# EAGLE design smd_test_rig_with_pico (EAGLE 9.6.2)
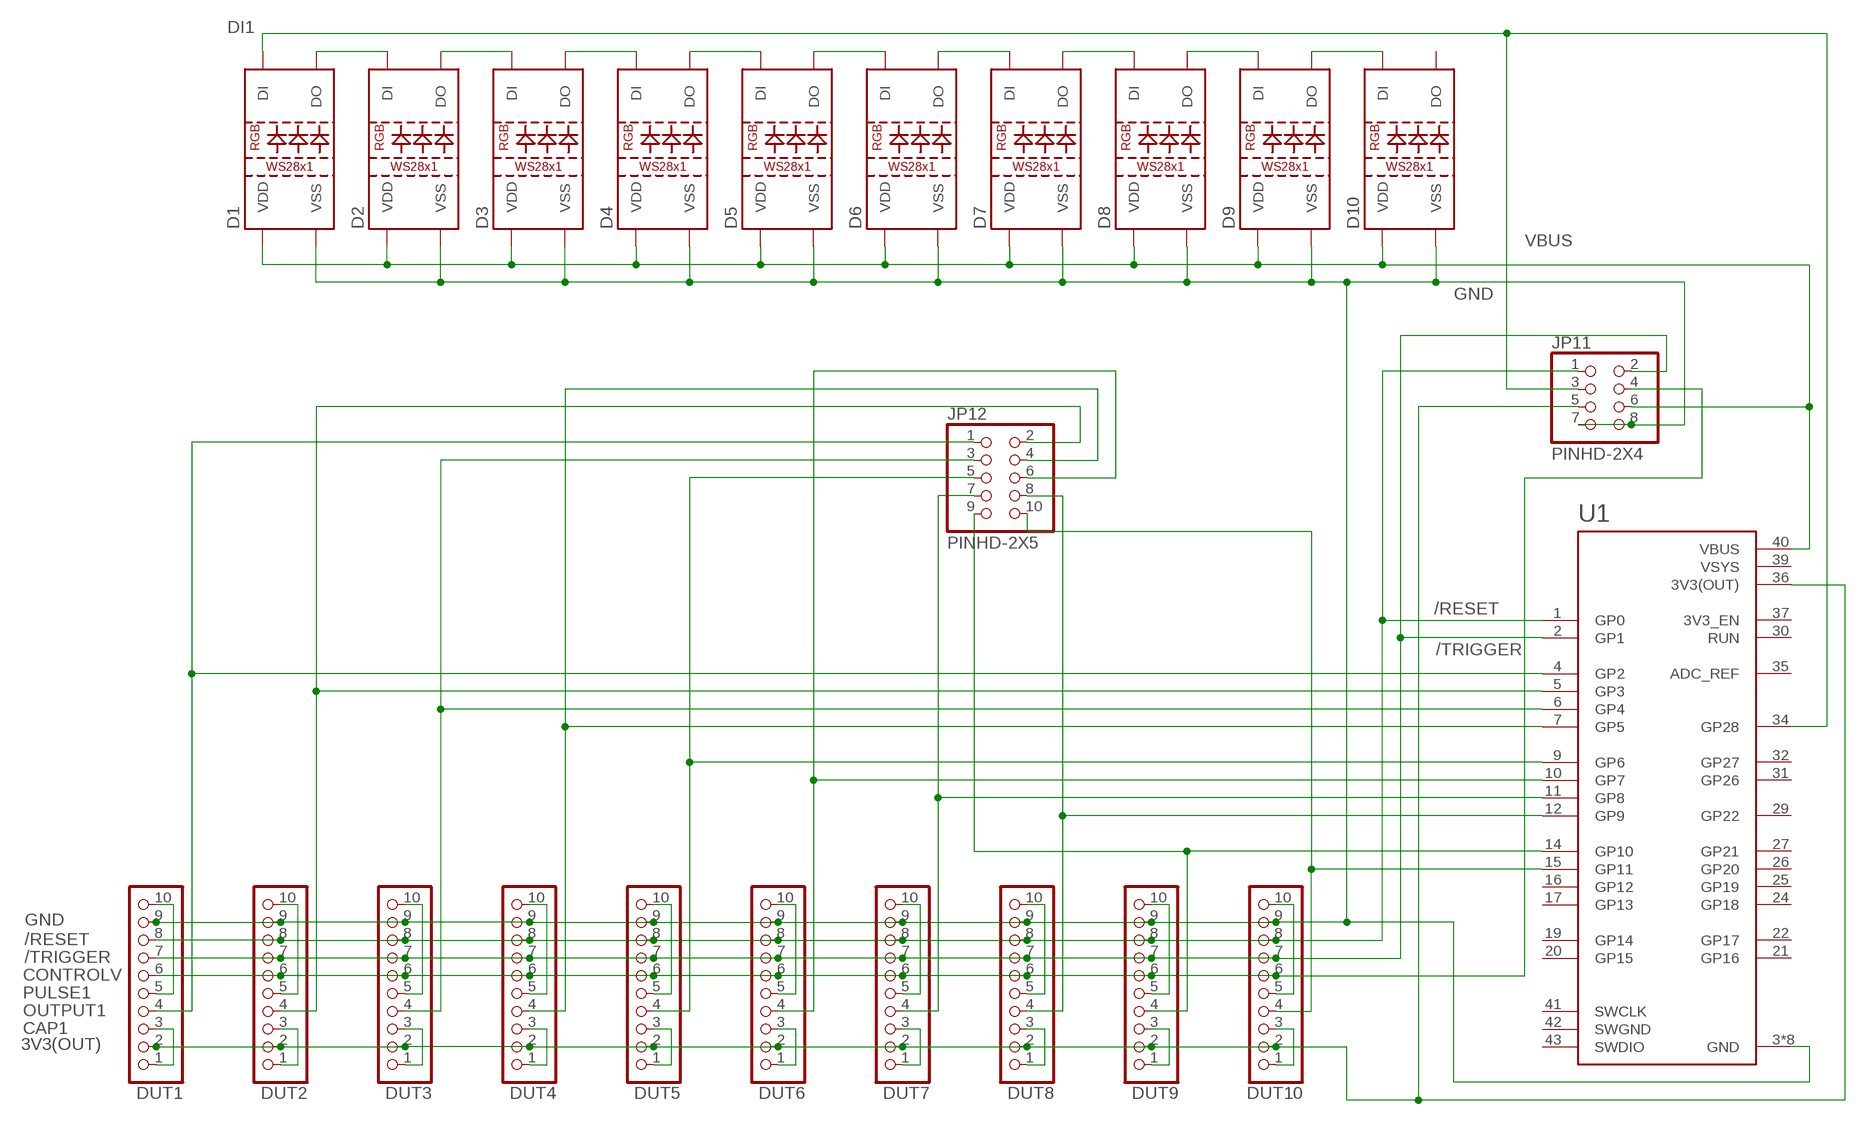
[diagram p0: schematic, sheet 1]

## Parts
D1  WS2812B  [WS2812B]
D2  WS2812B  [WS2812B]
D3  WS2812B  [WS2812B]
D4  WS2812B  [WS2812B]
D5  WS2812B  [WS2812B]
D6  WS2812B  [WS2812B]
D7  WS2812B  [WS2812B]
D8  WS2812B  [WS2812B]
D9  WS2812B  [WS2812B]
D10  WS2812B  [WS2812B]
DUT1  PINHD-1X10  [1X10]
DUT2  PINHD-1X10  [1X10]
DUT3  PINHD-1X10  [1X10]
DUT4  PINHD-1X10  [1X10]
DUT5  PINHD-1X10  [1X10]
DUT6  PINHD-1X10  [1X10]
DUT7  PINHD-1X10  [1X10]
DUT8  PINHD-1X10  [1X10]
DUT9  PINHD-1X10  [1X10]
DUT10  PINHD-1X10  [1X10]
JP11  PINHD-2X4  [2X04]
JP12  PINHD-2X5  [2X05]
U1  RASPBERRY_PICO  RASPBERRY_PICOTH  [PICO-PKG-TH]

## Nets
3V3(OUT): DUT1.2 DUT2.2 DUT3.2 DUT4.2 DUT5.2 DUT6.2 DUT7.2 DUT8.2 DUT9.2 DUT10.2 JP11.5 U1.36(3V3(OUT))
/RESET: DUT1.8 DUT2.8 DUT3.8 DUT4.8 DUT5.8 DUT6.8 DUT7.8 DUT8.8 DUT9.8 DUT10.8 JP11.1 U1.1(GP0)
/TRIGGER: DUT1.7 DUT2.7 DUT3.7 DUT4.7 DUT5.7 DUT6.7 DUT7.7 DUT8.7 DUT9.7 DUT10.7 JP11.2 U1.2(GP1)
CAP1: DUT1.1 DUT1.3
CAP2: DUT2.1 DUT2.3
CAP3: DUT3.1 DUT3.3
CAP4: DUT4.1 DUT4.3
CAP5: DUT5.1 DUT5.3
CAP6: DUT6.1 DUT6.3
CAP7: DUT7.1 DUT7.3
CAP8: DUT8.1 DUT8.3
CAP9: DUT9.1 DUT9.3
CAP10: DUT10.1 DUT10.3
CONTROLV: DUT1.6 DUT2.6 DUT3.6 DUT4.6 DUT5.6 DUT6.6 DUT7.6 DUT8.6 DUT9.6 DUT10.6 JP11.4
DI1: D1.4(DI) JP11.3 U1.34(GP28)
GND: D1.3(VSS) D2.3(VSS) D3.3(VSS) D4.3(VSS) D5.3(VSS) D6.3(VSS) D7.3(VSS) D8.3(VSS) D9.3(VSS) D10.3(VSS) DUT1.9 DUT2.9 DUT3.9 DUT4.9 DUT5.9 DUT6.9 DUT7.9 DUT8.9 DUT9.9 DUT10.9 JP11.7 JP11.8 U1.3(GND) U1.8(GND) U1.13(GND) U1.18(GND) U1.23(GND) U1.28(GND) U1.33(GND) U1.38(GND)
N$1: D1.2(DO) D2.4(DI)
N$2: D2.2(DO) D3.4(DI)
N$3: D3.2(DO) D4.4(DI)
N$4: D4.2(DO) D5.4(DI)
N$5: D5.2(DO) D6.4(DI)
N$6: D6.2(DO) D7.4(DI)
N$7: D7.2(DO) D8.4(DI)
N$8: D8.2(DO) D9.4(DI)
N$9: D9.2(DO) D10.4(DI)
OUTPUT1: DUT1.4 JP12.1 U1.4(GP2)
OUTPUT2: DUT2.4 JP12.2 U1.5(GP3)
OUTPUT3: DUT3.4 JP12.3 U1.6(GP4)
OUTPUT4: DUT4.4 JP12.4 U1.7(GP5)
OUTPUT5: DUT5.4 JP12.5 U1.9(GP6)
OUTPUT6: DUT6.4 JP12.6 U1.10(GP7)
OUTPUT7: DUT7.4 JP12.7 U1.11(GP8)
OUTPUT8: DUT8.4 JP12.8 U1.12(GP9)
OUTPUT9: DUT9.4 JP12.9 U1.14(GP10)
OUTPUT10: DUT10.4 JP12.10 U1.15(GP11)
PULSE1: DUT1.5 DUT1.10
PULSE2: DUT2.5 DUT2.10
PULSE3: DUT3.5 DUT3.10
PULSE4: DUT4.5 DUT4.10
PULSE5: DUT5.5 DUT5.10
PULSE6: DUT6.5 DUT6.10
PULSE7: DUT7.5 DUT7.10
PULSE8: DUT8.5 DUT8.10
PULSE9: DUT9.5 DUT9.10
PULSE10: DUT10.5 DUT10.10
VBUS: D1.1(VDD) D2.1(VDD) D3.1(VDD) D4.1(VDD) D5.1(VDD) D6.1(VDD) D7.1(VDD) D8.1(VDD) D9.1(VDD) D10.1(VDD) JP11.6 U1.40(VBUS)
Unconnected: D10.2(DO) U1.16(GP12) U1.17(GP13) U1.19(GP14) U1.20(GP15) U1.21(GP16) U1.22(GP17) U1.24(GP18) U1.25(GP19) U1.26(GP20) U1.27(GP21) U1.29(GP22) U1.30(RUN) U1.31(GP26) U1.32(GP27) U1.35(ADC_REF) U1.37(3V3_EN) U1.41(SWCLK) U1.43(SWDIO)

## Power pins joined to a net without a drawn wire
SWGND: U1.42(SWGND)
VSYS: U1.39(VSYS)

## Library data of the parts
D1-D10 = SparkFun-LED:WS2812B: WS2812B SMD addressable RGB LED 5x5mm SMD LED with built-in controller IC. Color: Red/Green/Blue mC Rating: RGB: 390, 660, 180 mcd Forward Voltage: RGB: 2.0, 3.0, 3.0 V Packages:WS2812B SparkFun Products: Blynk Board - ESP8266 <https://www.sparkfun.com/products/13794>; PROD_ID: DIO-12503
DUT1-DUT10 = Connector:PINHD-1X10: PIN HEADER; CATEGORY: CONNECTOR; SUB-CATEGORY: PIN-HEADER
JP11 = Connector:PINHD-2X4: PIN HEADER; CATEGORY: CONNECTOR; SUB-CATEGORY: PIN-HEADER
JP12 = Connector:PINHD-2X5: PIN HEADER; CATEGORY: CONNECTOR; SUB-CATEGORY: PIN-HEADER
U1 = RpiPico:RASPBERRY_PICO: Raspberry Pi Pico

## Board
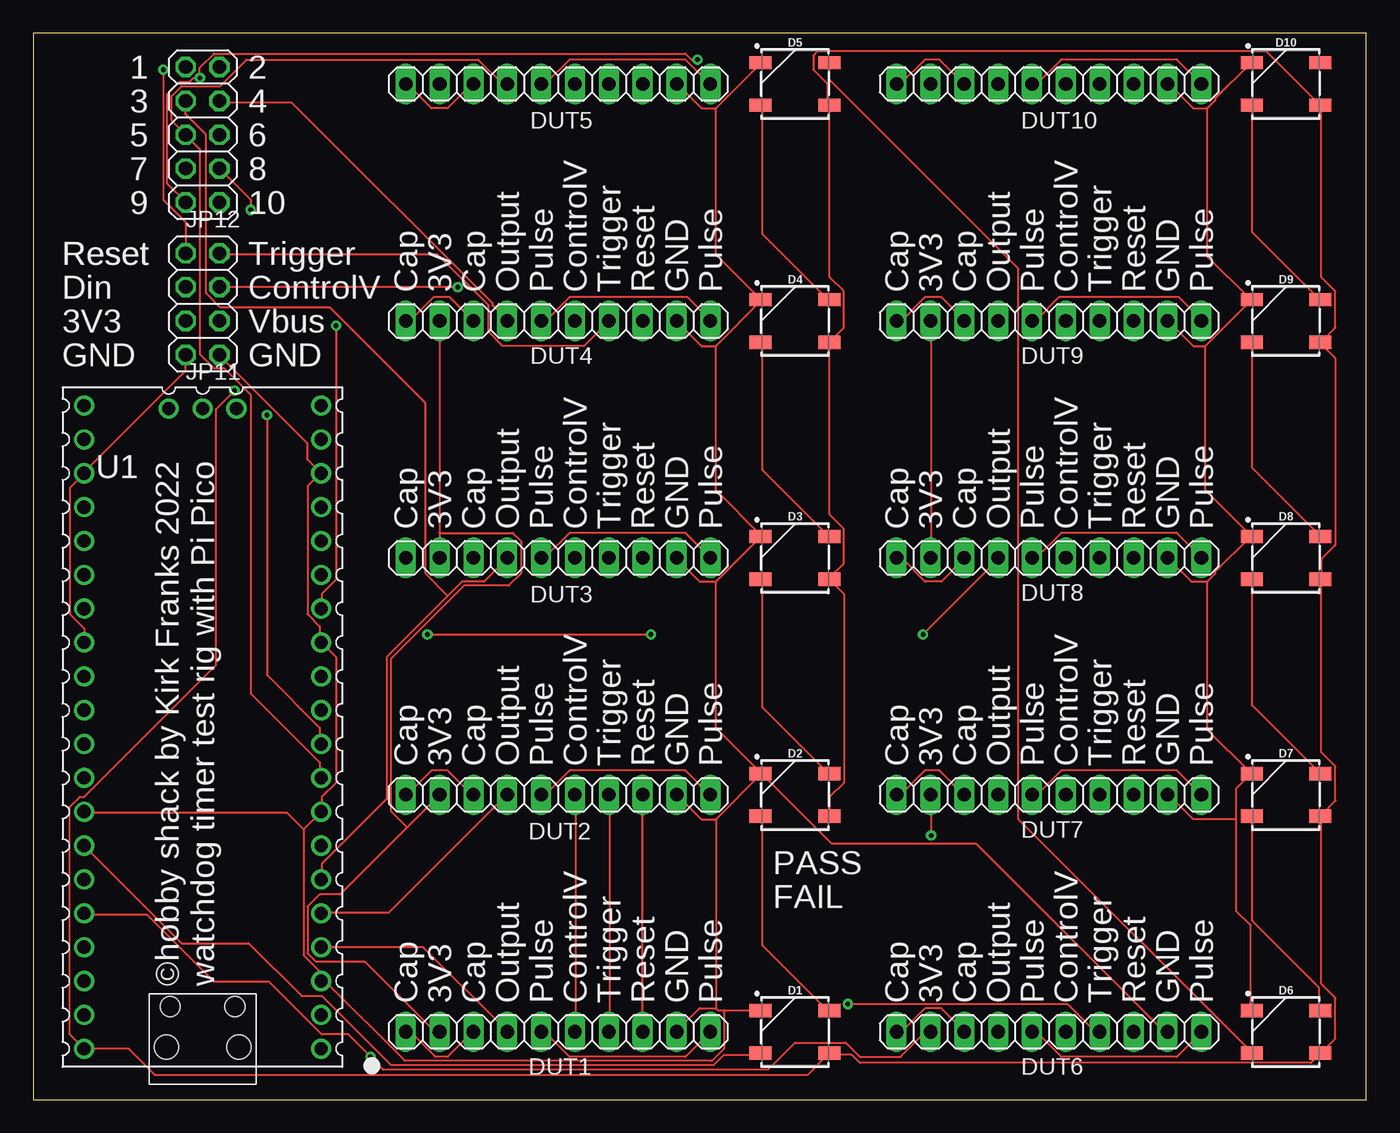
[diagram p1: board, top side]
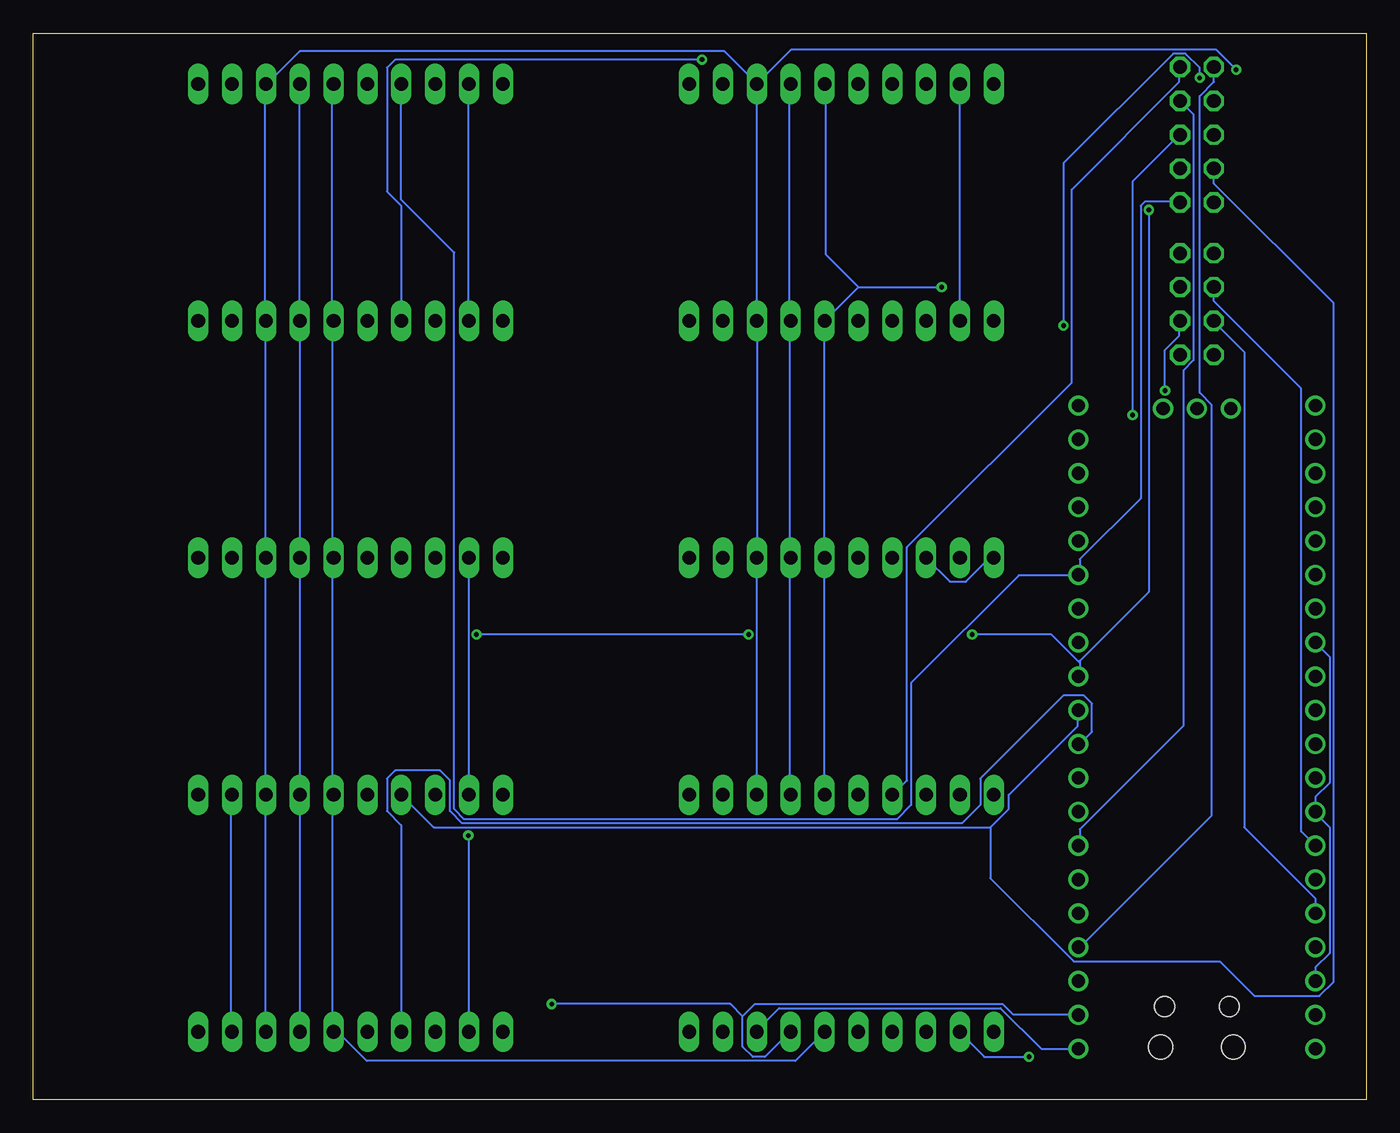
[diagram p2: board, bottom side, seen from below]

Size 100 x 80 mm. Coordinates in mm from the lower left corner, seen from the top.
Outline: 0,0 100,0 100,80 0,80 0,0
Copper layers (1*16): Top 0.035mm / dielectric 1.5mm / Bottom 0.035mm
Design rules "default": minimum track width 6mil, minimum drill 0.35mm, track to track 6mil, track to pad 6mil, pad to pad 6mil, via to via 6mil, smd to smd 6mil, copper to edge 40mil, drill to drill 6mil, minimum pad ring 10mil, minimum via ring 8mil, stop-mask expansion 4mil, vias tented up to drill 0mil, thermal gap 10mil

### Footprints (pad centres in the part's own frame; a part is rotated, then mirrored left to right if it is on the bottom)
WS2812B = smd 1.651 x 1: 1 2.577,-1.6; 2 2.577,1.6; 3 -2.577,1.6; 4 -2.577,-1.6
1X10 = drill 1.016 long: 1 -11.43,0; 2 -8.89,0; 3 -6.35,0; 4 -3.81,0; 5 -1.27,0; 6 1.27,0; 7 3.81,0; 8 6.35,0; 9 8.89,0; 10 11.43,0
2X04 = drill 1.016 octagon: 1 -3.81,-1.27; 2 -3.81,1.27; 3 -1.27,-1.27; 4 -1.27,1.27; 5 1.27,-1.27; 6 1.27,1.27; 7 3.81,-1.27; 8 3.81,1.27
2X05 = drill 1.016 octagon: 1 -5.08,-1.27; 2 -5.08,1.27; 3 -2.54,-1.27; 4 -2.54,1.27; 5 0,-1.27; 6 0,1.27; 7 2.54,-1.27; 8 2.54,1.27; 9 5.08,-1.27; 10 5.08,1.27
PICO-PKG-TH = drill 1: 1 -8.89,24.13; 2 -8.89,21.59; 3 -8.89,19.05; 4 -8.89,16.51; 5 -8.89,13.97; 6 -8.89,11.43; 7 -8.89,8.89; 8 -8.89,6.35; 9 -8.89,3.81; 10 -8.89,1.27; 11 -8.89,-1.27; 12 -8.89,-3.81; 13 -8.89,-6.35; 14 -8.89,-8.89; 15 -8.89,-11.43; 16 -8.89,-13.97; 17 -8.89,-16.51; 18 -8.89,-19.05; 19 -8.89,-21.59; 20 -8.89,-24.13; 21 8.89,-24.13; 22 8.89,-21.59; 23 8.89,-19.05; 24 8.89,-16.51; 25 8.89,-13.97; 26 8.89,-11.43; 27 8.89,-8.89; 28 8.89,-6.35; 29 8.89,-3.81; 30 8.89,-1.27; 31 8.89,1.27; 32 8.89,3.81; 33 8.89,6.35; 34 8.89,8.89; 35 8.89,11.43; 36 8.89,13.97; 37 8.89,16.51; 38 8.89,19.05; 39 8.89,21.59; 40 8.89,24.13; 41 -2.54,-23.9; 42 0,-23.9; 43 2.54,-23.9 | hole 1.8: -2.725,24; 2.725,24 | hole 1.5: -2.425,20.97; 2.425,20.97

### Placement (x,y rotation side)
D1  57.15,5.08 0 top
D2  57.15,22.86 0 top
D3  57.15,40.64 0 top
D4  57.15,58.42 0 top
D5  57.15,76.2 0 top
D6  93.98,5.08 0 top
D7  93.98,22.86 0 top
D8  93.98,40.64 0 top
D9  93.98,58.42 0 top
D10  93.98,76.2 0 top
DUT1  39.37,5.08 0 top
DUT2  39.37,22.86 0 top
DUT3  39.37,40.64 0 top
DUT4  39.37,58.42 0 top
DUT5  39.37,76.2 0 top
DUT6  76.2,5.08 0 top
DUT7  76.2,22.86 0 top
DUT8  76.2,40.64 0 top
DUT9  76.2,58.42 0 top
DUT10  76.2,76.2 0 top
JP11  12.7,59.69 270 top
JP12  12.7,72.39 270 top
U1  12.7,27.94 180 top

### Tracks (layer width: path | path; a pad name or v marks a point on that pad's centre or on a via)
3V3(OUT)  (via drill 0.35)
  Top 0.152: v67.36,19.81 67.36,22.86 DUT7.2 | DUT8.2 67.36,40.69 67.36,58.37 DUT9.2 | DUT2.2 28.04,20.42 | 28.04,20.42 23.01,15.39 21.49,15.39 20.57,14.48 20.57,10.97 21.18,10.36 24.84,10.36 30.02,5.18 30.48,5.18 DUT1.2 | DUT4.2 30.48,42.52 | 30.48,42.52 DUT3.2 | 28.04,20.42 26.82,21.64 26.82,33.07 32.31,38.56 35.66,38.56 36.58,39.47 36.58,41.91 35.97,42.52 30.48,42.52 | U1.36 3.81,13.87 8.53,13.87 13.56,8.84 17.68,8.84 21.64,4.88 23.62,4.88 v25.3,3.2 26.21,2.29 55.17,2.29 57.15,4.27 60.96,4.27 62.03,3.2 65.08,3.2 66.9,5.03 67.21,5.03 DUT6.2
  Bottom 0.152: v67.36,19.81 67.36,5.18 DUT6.2 | DUT10.2 67.36,76.2 67.36,58.52 DUT9.2 | DUT7.2 67.36,22.86 67.36,40.54 DUT8.2 | U1.36 3.81,15.09 9.14,20.42 9.14,56.08 11.43,58.37 JP11.5 | DUT4.2 DUT5.2 | v25.3,3.2 28.65,3.2 30.48,5.03 DUT1.2
/RESET  (via drill 0.35)
  Top 0.152: JP11.1 11.43,65.84 9.75,67.51 v9.75,77.27 | DUT1.8 DUT2.8
  Bottom 0.152: 82.6,22.86 82.6,5.18 DUT6.8 | 82.6,22.86 82.6,40.54 DUT8.8 82.6,40.69 82.6,58.37 DUT9.8 82.6,58.52 82.6,76.2 DUT10.8 82.45,76.2 80.01,78.64 48.16,78.64 DUT5.8 | 82.6,22.86 DUT7.8 | v9.75,77.27 11.28,78.79 43.13,78.79 DUT5.8 | U1.1 24.38,3.81 27.43,6.86 44.04,6.86 45.72,5.18 DUT1.8 | DUT2.8 DUT3.8 DUT4.8 DUT5.8
/TRIGGER  (via drill 0.35)
  Top 0.152: DUT2.7 43.28,22.86 43.28,5.18 DUT1.7 | DUT4.7 41.3,56.54 35.2,56.54 34.14,57.61 34.14,59.59 30.33,63.4 14.02,63.4 JP11.2 | v61.11,7.16 77.57,7.16 79.55,5.18 80.01,5.18 DUT6.7
  Bottom 0.152: DUT6.7 DUT7.7 DUT8.7 DUT9.7 DUT10.7 | 46.79,6.25 45.87,7.16 27.28,7.16 26.52,6.4 21.64,6.4 U1.2 | 46.79,6.25 46.79,3.96 46.02,3.2 45.11,3.2 43.28,5.03 DUT1.7 | DUT5.7 43.28,76.2 43.28,58.52 DUT4.7 43.28,58.37 43.28,40.69 DUT3.7 43.28,40.54 43.28,22.86 DUT2.7 | v61.11,7.16 47.7,7.16 46.79,6.25
CAP1
  Top 0.152: DUT1.1 28.04,5.03 28.35,5.03 30.18,3.2 31.09,3.2 32.92,5.03 DUT1.3
CAP2
  Top 0.152: DUT2.1 28.04,22.86 29.87,24.69 31.09,24.69 32.92,22.86 DUT2.3
CAP3
  Bottom 0.152: DUT3.3 31.24,38.86 30.02,38.86 28.35,40.54 28.04,40.54 DUT3.1
CAP4
  Top 0.152: DUT4.3 31.24,60.2 30.02,60.2 28.35,58.52 28.04,58.52 DUT4.1
CAP5
  Top 0.152: DUT5.1 28.04,76.2 29.87,74.37 31.09,74.37 32.92,76.2 DUT5.3
CAP6
  Top 0.152: DUT6.1 64.77,5.18 65.23,5.18 66.9,6.86 68.12,6.86 69.8,5.18 DUT6.3
CAP7
  Top 0.152: DUT7.1 65.08,22.86 66.9,24.69 67.97,24.69 69.8,22.86 DUT7.3
CAP8
  Top 0.152: DUT8.1 64.77,40.54 65.23,40.54 66.9,38.86 68.12,38.86 69.8,40.54 DUT8.3
CAP9
  Top 0.152: DUT9.1 64.77,58.52 65.23,58.52 66.9,60.2 68.12,60.2 69.8,58.52 DUT9.3
CAP10
  Top 0.152: DUT10.1 65.08,76.2 66.9,78.03 67.97,78.03 69.8,76.2 DUT10.3
CONTROLV  (via drill 0.35)
  Top 0.152: DUT1.6 40.69,5.18 40.69,22.86 DUT2.6 | v31.85,60.96 JP11.4
  Bottom 0.152: 77.57,22.86 77.57,5.18 DUT6.6 77.42,5.03 77.11,5.03 74.98,2.9 42.82,2.9 DUT1.6 | DUT10.6 77.57,76.2 77.57,58.52 DUT9.6 77.57,58.37 77.57,40.69 DUT8.6 77.57,40.54 77.57,22.86 | 77.57,22.86 DUT7.6 | 38.1,60.96 v31.85,60.96 | 38.1,60.96 DUT4.6 40.69,58.37 40.69,40.69 DUT3.6 40.69,40.54 40.69,22.86 DUT2.6 | 38.1,60.96 40.54,63.4 40.54,76.2 DUT5.6
DI1
  Top 0.152: U1.34 11.12,11.73 16.15,11.73 20.12,7.77 21.64,7.77 26.82,2.59 51.05,2.59 51.82,3.35 54.56,3.35 D1.4
  Bottom 0.152: JP11.3 11.43,59.89 4.88,53.34 4.88,20.12 U1.34
GND
  Top 0.152: 88.09,74.37 88.7,74.98 88.7,75.13 91.29,77.72 D10.3 | 88.09,74.37 87.02,74.37 85.19,76.2 DUT10.9 | 87.94,56.54 91.29,59.89 D9.3 91.29,60.05 88.09,63.25 88.09,74.37 | 87.94,56.54 87.02,56.54 85.19,58.37 DUT9.9 | 88.09,38.86 88.7,39.47 88.7,39.62 91.29,42.22 D8.3 91.29,42.37 87.94,45.72 87.94,56.54 | 88.09,38.86 86.87,38.86 DUT8.9 | 90.22,21.03 90.22,23.32 91.29,24.38 D7.3 91.29,24.54 88.09,27.74 88.09,38.86 | 90.22,21.03 90.22,14.17 91.29,13.11 91.29,6.71 D6.3 | 90.22,21.03 87.02,21.03 85.19,22.86 DUT7.9 | U1.28 3.81,35.36 2.74,36.42 2.74,45.87 3.81,46.94 U1.23 3.81,47.09 11.43,54.71 JP11.7 | 20.27,20.27 20.27,10.82 21.49,9.6 21.49,8.99 U1.3 21.64,8.84 21.95,8.84 27.89,2.9 50.9,2.9 51.82,3.81 51.82,6.71 | 20.27,20.27 U1.8 21.64,21.64 21.64,22.71 22.71,23.77 22.71,33.22 21.64,34.29 U1.13 21.49,34.29 21.49,35.51 20.57,36.42 20.57,46.02 21.49,46.94 U1.18 20.57,48.01 20.57,49.23 14.02,55.78 JP11.8 | 20.27,20.27 19.05,21.49 3.81,21.49 U1.33 | 51.21,74.37 54.56,77.72 D5.3 | 51.21,74.37 50.14,74.37 48.31,76.2 DUT5.9 | 51.21,56.54 54.56,59.89 D4.3 54.56,60.05 51.21,63.4 51.21,74.37 | 51.21,56.54 50.14,56.54 DUT4.9 | 51.21,38.86 54.56,42.22 D3.3 54.56,42.37 51.21,45.72 51.21,56.54 | 51.21,38.86 49.99,38.86 48.31,40.54 DUT3.9 | 51.82,6.71 51.36,6.71 51.21,6.86 | 51.82,6.71 54.56,6.71 D1.3 | 51.21,6.86 49.99,6.86 48.31,5.18 DUT1.9 | 51.21,21.03 54.56,24.38 D2.3 | 51.21,21.03 50.14,21.03 48.31,22.86 DUT2.9 | 51.21,21.03 51.21,6.86 | 51.21,38.86 51.21,27.89 54.56,24.54 D2.3 | DUT6.9 85.04,5.18 84.73,5.18 70.71,19.2 59.89,19.2 54.71,24.38 D2.3
  Bottom 0.152: DUT6.9 85.19,5.18 85.19,22.86 DUT7.9 | U1.38 3.81,9.91 2.74,10.97 2.74,20.42 3.81,21.49 U1.33 3.81,22.71 2.74,23.77 2.74,33.22 U1.28
N$1
  Top 0.152: D2.4 54.71,21.18 54.71,11.58 59.59,6.71 D1.2
N$2
  Top 0.152: D3.4 54.71,39.01 54.71,29.41 59.59,24.54 D2.2
N$3
  Top 0.152: D4.4 54.71,56.69 54.71,47.24 59.59,42.37 D3.2
N$4
  Top 0.152: D5.4 54.71,74.52 54.71,64.92 59.59,60.05 D4.2
N$5
  Top 0.152: D5.2 59.74,77.72 59.74,76.5 73.91,62.33 73.91,21.03 91.44,3.5 D6.4
N$6
  Top 0.152: D7.4 91.44,21.18 91.44,13.41 96.47,8.38 96.47,6.71 D6.2
N$7
  Top 0.152: D8.4 91.44,39.01 91.44,29.57 96.47,24.54 D7.2
N$8
  Top 0.152: D9.4 91.44,56.69 91.44,47.4 96.47,42.37 D8.2
N$9
  Top 0.152: D10.4 91.44,74.52 91.44,65.08 96.47,60.05 D9.2
OUTPUT1
  Top 0.152: U1.4 29.26,11.43 35.51,5.18 DUT1.4
  Bottom 0.152: JP12.1 11.43,76.35 12.5,75.29 12.5,53.03 11.58,52.12 11.58,21.34 21.49,11.43 U1.4
OUTPUT2
  Top 0.152: U1.5 21.64,14.02 26.67,14.02 35.51,22.86 DUT2.4
  Bottom 0.152: JP12.2 14.02,77.42 14.02,76.35 22.1,68.28 22.1,53.8 34.44,41.45 34.44,23.93 35.51,22.86 DUT2.4
OUTPUT3
  Top 0.152: 31.09,37.8 32.16,38.86 33.83,38.86 35.51,40.54 DUT3.4 | 31.09,37.8 26.52,33.22 26.52,22.55 21.64,17.68 21.64,16.61 U1.6 | JP12.3 11.43,73.91 12.95,72.39 12.95,60.5 14.02,59.44 22.25,59.44 29.41,52.27 29.41,39.47 31.09,37.8
OUTPUT4
  Top 0.152: DUT4.4 35.51,58.52 34.44,59.59 34.44,59.74 19.36,74.83 14.02,74.83 JP12.4
  Bottom 0.152: JP12.4 12.95,73.91 12.95,55.47 13.72,54.71 13.72,28.04 21.49,20.27 21.49,19.05 U1.7
OUTPUT5
  Top 0.152: U1.9 21.49,24.23 21.49,25.3 16.31,30.48 16.31,52.88 14.33,54.86 13.56,54.86 12.5,55.93 12.5,71.32 JP12.5 10.36,73.46 10.36,75.29 11.12,76.05 14.02,76.05 16,78.03 33.38,78.03 35.2,76.2 DUT5.4
OUTPUT6  (via drill 0.35)
  Top 0.152: v17.53,51.36 17.53,31.85 21.49,27.89 21.49,26.67 U1.10
  Bottom 0.152: v17.53,51.36 17.53,68.89 14.02,72.39 JP12.6 | DUT6.4 72.39,20.57 73.46,21.64 73.46,24.08 72.85,24.69 69.49,24.69 68.73,23.93 68.73,21.64 67.82,20.73 30.33,20.73 28.96,22.1 28.96,24.08 22.71,30.33 21.18,30.33 20.57,29.72 20.57,27.58 21.49,26.67 U1.10
OUTPUT7
  Bottom 0.152: 28.19,20.42 26.82,21.79 26.82,22.86 21.64,28.04 21.64,29.11 U1.11 | 28.19,20.42 69.95,20.42 DUT7.4 | JP12.7 11.43,68.73 2.44,59.74 2.44,8.84 3.5,7.77 8.38,7.77 10.97,10.36 21.95,10.36 28.19,16.61 28.19,20.42
OUTPUT8  (via drill 0.35)
  Top 0.152: v16.31,66.75 16.31,67.51 JP12.8 | v66.75,34.9 72.39,40.54 DUT8.4 | v29.57,34.9 v46.33,34.9
  Bottom 0.152: 21.49,32.77 21.49,32.92 16.31,38.1 v16.31,66.75 | 21.49,32.77 21.49,31.85 U1.12 | v46.33,34.9 v66.75,34.9 | v29.57,34.9 23.62,34.9 21.49,32.77
OUTPUT9  (via drill 0.35)
  Top 0.152: v22.71,58.06 22.71,39.01 21.64,37.95 21.64,36.88 U1.14 | JP12.9 11.43,67.36 10.06,68.73 10.06,75.44 10.97,76.35 11.73,76.35 12.04,76.66 v12.5,76.66 12.5,77.42 13.56,78.49 48.92,78.49 49.38,78.03 v49.84,78.03
  Bottom 0.152: v22.71,58.06 22.71,70.26 14.48,78.49 13.56,78.49 12.5,77.42 v12.5,76.66 | DUT9.4 72.39,67.06 73.46,68.12 73.46,77.42 72.85,78.03 v49.84,78.03
OUTPUT10
  Bottom 0.152: JP12.10 14.02,67.36 16.61,67.36 16.92,67.06 16.92,45.11 21.49,40.54 21.49,39.47 U1.15 21.64,39.32 26.06,39.32 34.14,31.24 34.14,22.1 35.2,21.03 67.67,21.03 68.43,21.79 68.43,63.55 72.39,67.51 DUT10.4
PULSE1
  Top 0.152: DUT1.10 48.92,3.2 40.23,3.2 38.41,5.03 38.1,5.03 DUT1.5
PULSE2
  Top 0.152: DUT2.5 38.41,22.86 40.23,24.69 48.92,24.69 50.75,22.86 DUT2.10
PULSE3
  Top 0.152: DUT3.10 48.92,42.52 40.23,42.52 38.41,40.69 38.1,40.69 DUT3.5
PULSE4
  Top 0.152: DUT4.5 38.1,58.52 38.56,58.52 40.23,60.2 49.07,60.2 50.75,58.52 DUT4.10
PULSE5
  Top 0.152: DUT5.5 38.41,76.2 40.23,78.03 48.92,78.03 50.75,76.2 DUT5.10
PULSE6
  Top 0.152: DUT6.5 74.98,5.03 75.29,5.03 77.11,3.2 85.8,3.2 87.63,5.03 DUT6.10
PULSE7
  Top 0.152: DUT7.5 75.29,22.86 77.11,24.69 85.8,24.69 DUT7.10
PULSE8
  Top 0.152: DUT8.5 74.98,40.69 75.29,40.69 77.11,42.52 85.8,42.52 87.63,40.69 DUT8.10
PULSE9
  Top 0.152: DUT9.5 74.98,58.52 75.29,58.52 76.96,60.2 85.95,60.2 87.63,58.52 DUT9.10
PULSE10
  Top 0.152: DUT10.5 75.29,76.2 77.11,78.03 85.8,78.03 DUT10.10
VBUS  (via drill 0.35)
  Top 0.152: D2.1 59.74,21.34 59.74,22.71 60.81,23.77 60.81,37.95 59.74,39.01 D3.1 59.74,39.17 60.81,40.23 60.81,42.82 59.74,43.89 59.74,56.69 D4.1 59.74,56.84 60.81,57.91 60.81,60.66 59.74,61.72 59.74,74.52 D5.1 59.59,74.68 59.59,76.2 58.52,77.27 58.52,78.33 58.83,78.64 92.51,78.64 96.47,74.68 D10.1 96.62,74.52 96.62,61.72 97.69,60.66 97.69,57.91 96.62,56.84 D9.1 96.62,56.69 97.69,55.63 97.69,41.6 96.62,40.54 96.62,39.17 D8.1 96.62,39.01 96.62,26.06 97.69,24.99 97.69,22.4 96.62,21.34 D7.1 96.62,21.18 96.62,8.69 97.69,7.62 97.69,4.57 96.62,3.5 D6.1 96.47,3.35 95.86,2.74 62.03,2.74 61.42,3.35 59.74,3.35 D1.1 59.59,3.35 58.06,1.83 9.14,1.83 7.16,3.81 U1.40 2.74,4.88 2.74,21.95 3.5,22.71 3.81,22.71 13.72,32.61 13.72,51.82 v15.09,53.19
  Bottom 0.152: v15.09,53.19 15.09,56.24 14.02,57.3 14.02,58.37 JP11.6

### Text on the board
tNames: 1 | 2 | 3 | 4 | 5 | 6 | 7 | 8 | 9 | 10 | Reset | Reset | Trigger | Cap | 3V3 | Cap | Output | Pulse | ControlV | Trigger | Reset | GND | Pulse | Cap | 3V3 | Cap | Output | Pulse | ControlV | Trigger | Reset | GND | Pulse | Din | ControlV | 3V3 | Vbus | GND | GND | Cap | 3V3 | Cap | Output | Pulse | ControlV | Trigger | Reset | GND | Pulse | Cap | 3V3 | Cap | Output | Pulse | ControlV | Trigger | Reset | GND | Pulse | Cap | 3V3 | Cap | Output | Pulse | ControlV | Trigger | Reset | GND | Pulse | Cap | 3V3 | Cap | Output | Pulse | ControlV | Trigger | Reset | GND | Pulse | PASS | FAIL | ©hobby shack by Kirk Franks 2022 / watchdog timer test rig with Pi Pico | Cap | 3V3 | Cap | Output | Pulse | ControlV | Trigger | Reset | GND | Pulse | Cap | 3V3 | Cap | Output | Pulse | ControlV | Trigger | Reset | GND | Pulse